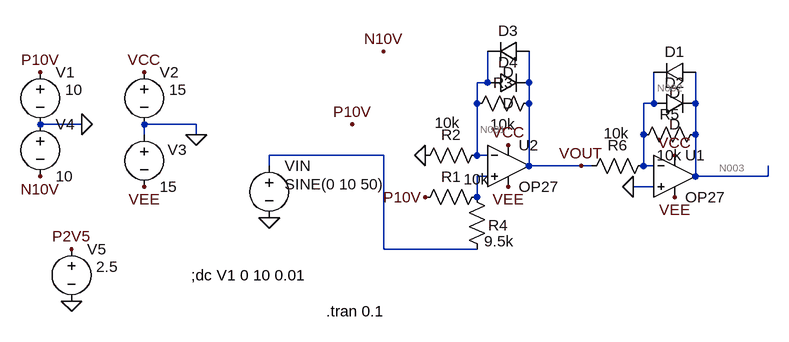
[diagram p0: schematic Draft28.asc]
Draft28.asc, the LTspice schematic file:
Version 4
SHEET 1 904 680
WIRE 384 -32 384 -80
WIRE 384 -32 368 -32
WIRE 448 -32 448 -80
WIRE 368 0 368 -32
WIRE 448 0 448 -32
WIRE 640 0 640 -48
WIRE 640 0 624 0
WIRE 704 0 704 -48
WIRE -240 32 -304 32
WIRE -64 32 -144 32
WIRE -144 48 -144 32
WIRE -64 48 -64 32
WIRE 624 48 624 0
WIRE 704 48 704 0
WIRE 224 80 48 80
WIRE 368 80 368 0
WIRE 384 80 368 80
WIRE 48 96 48 80
WIRE 448 96 448 0
WIRE 528 96 448 96
WIRE 544 96 528 96
WIRE 624 96 624 48
WIRE 640 96 624 96
WIRE 384 112 368 112
WIRE 704 112 704 48
WIRE 816 112 816 96
WIRE 816 112 704 112
WIRE 640 128 608 128
WIRE 368 144 368 112
WIRE 224 224 224 80
WIRE 368 224 224 224
FLAG 48 176 0
FLAG -64 48 0
FLAG 528 96 VOUT
FLAG -144 -48 VCC
FLAG 416 64 VCC
FLAG -144 128 VEE
FLAG 416 128 VEE
FLAG -240 32 0
FLAG -304 -48 P10V
FLAG -304 112 N10V
FLAG 176 32 P10V
FLAG 672 80 VCC
FLAG 672 144 VEE
FLAG 224 -80 N10V
FLAG -256 304 0
FLAG -256 224 P2V5
FLAG 288 80 0
FLAG 288 144 P10V
FLAG 608 128 0
SYMBOL voltage 48 80 R0
WINDOW 123 0 0 Left 0
WINDOW 39 0 0 Left 0
WINDOW 3 24 44 Left 2
SYMATTR Value SINE(0 10 50)
SYMATTR InstName VIN
SYMBOL voltage -144 -64 R0
WINDOW 123 0 0 Left 0
WINDOW 39 0 0 Left 0
WINDOW 3 38 43 Left 2
SYMATTR Value 15
SYMATTR InstName V2
SYMBOL voltage -144 32 R0
WINDOW 123 0 0 Left 0
WINDOW 39 0 0 Left 0
WINDOW 0 36 39 Left 2
SYMATTR InstName V3
SYMATTR Value 15
SYMBOL diode 704 -64 R90
WINDOW 0 0 32 VBottom 2
WINDOW 3 32 32 VTop 2
SYMATTR InstName D1
SYMBOL diode 640 16 R270
WINDOW 0 32 32 VTop 2
WINDOW 3 0 32 VBottom 2
SYMATTR InstName D2
SYMBOL res 384 64 R90
WINDOW 0 0 56 VBottom 2
WINDOW 3 -50 62 VTop 2
SYMATTR InstName R2
SYMATTR Value 10k
SYMBOL res 464 -16 R90
WINDOW 0 0 56 VBottom 2
WINDOW 3 32 56 VTop 2
SYMATTR InstName R3
SYMATTR Value 10k
SYMBOL OpAmps\\OP27 416 32 R0
SYMATTR InstName U2
SYMBOL voltage -304 -64 R0
WINDOW 123 0 0 Left 0
WINDOW 39 0 0 Left 0
WINDOW 3 38 43 Left 2
SYMATTR Value 10
SYMATTR InstName V1
SYMBOL voltage -304 16 R0
WINDOW 123 0 0 Left 0
WINDOW 39 0 0 Left 0
SYMATTR InstName V4
SYMATTR Value 10
SYMBOL res 384 128 R90
WINDOW 0 0 56 VBottom 2
WINDOW 3 -27 17 VTop 2
SYMATTR InstName R1
SYMATTR Value 10k
SYMBOL res 384 240 R180
WINDOW 0 -32 53 Left 2
WINDOW 3 -41 28 Left 2
SYMATTR InstName R4
SYMATTR Value 9.5k
SYMBOL OpAmps\\OP27 672 48 R0
SYMATTR InstName U1
SYMBOL res 720 32 R90
WINDOW 0 0 56 VBottom 2
WINDOW 3 32 56 VTop 2
SYMATTR InstName R5
SYMATTR Value 10k
SYMBOL res 640 80 R90
WINDOW 0 0 56 VBottom 2
WINDOW 3 -50 58 VTop 2
SYMATTR InstName R6
SYMATTR Value 10k
SYMBOL diode 448 -96 R90
WINDOW 0 0 32 VBottom 2
WINDOW 3 32 32 VTop 2
SYMATTR InstName D3
SYMBOL diode 384 -16 R270
WINDOW 0 32 32 VTop 2
WINDOW 3 0 32 VBottom 2
SYMATTR InstName D4
SYMBOL voltage -256 208 R0
WINDOW 123 0 0 Left 0
WINDOW 39 0 0 Left 0
WINDOW 3 38 43 Left 2
SYMATTR Value 2.5
SYMATTR InstName V5
TEXT -72 264 Left 2 !;dc V1 0 10 0.01
TEXT 136 320 Left 2 !.tran 0.1

The netlist it stands for:
* Draft28.asc
VIN N004 0 SINE(0 10 50)
V2 VCC 0 15
V3 0 VEE 15
D1 N003 N002 D
D2 N002 N003 D
R2 N001 0 10k
R3 VOUT N001 10k
XU2 N005 N001 VCC VEE VOUT OP27  ; pins In+ In- V+ V- OUT
V1 P10V 0 10
V4 0 N10V 10
R1 N005 P10V 10k
R4 N004 N005 9.5k
XU1 0 N002 VCC VEE N003 OP27  ; pins In+ In- V+ V- OUT
R5 N003 N002 10k
R6 N002 VOUT 10k
D3 VOUT N001 D
D4 N001 VOUT D
V5 P2V5 0 2.5
.model D D
.lib standard.dio
;dc V1 0 10 0.01
.tran 0.1
.lib ADI.lib
.backanno
.end

* Results of the author's LTspice run, read from the files saved beside the schematic
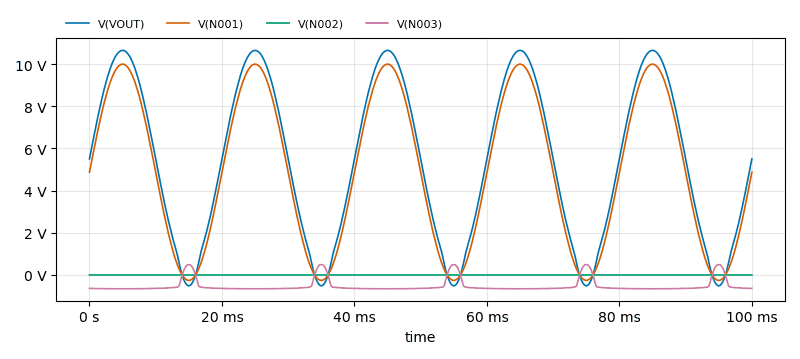
[diagram p1: Transient Analysis of Draft28.asc, plotted from the saved traces]
* Transient Analysis, 1 run:
*   V(VOUT): min -512.3 mV, max 10.65 V, average 5.389 V, rms 6.597 V, last 5.505 V
*   V(N001): min -256.2 mV, max 9.999 V, average 4.871 V, rms 6.075 V, last 4.872 V
*   V(N002): min -25.04 µV, max 24.56 µV, average 217.2 nV, rms 5.924 µV, last 517.9 nV
*   V(N003): min -655.1 mV, max 493.2 mV, average -517.8 mV, rms 599.9 mV, last -636.5 mV